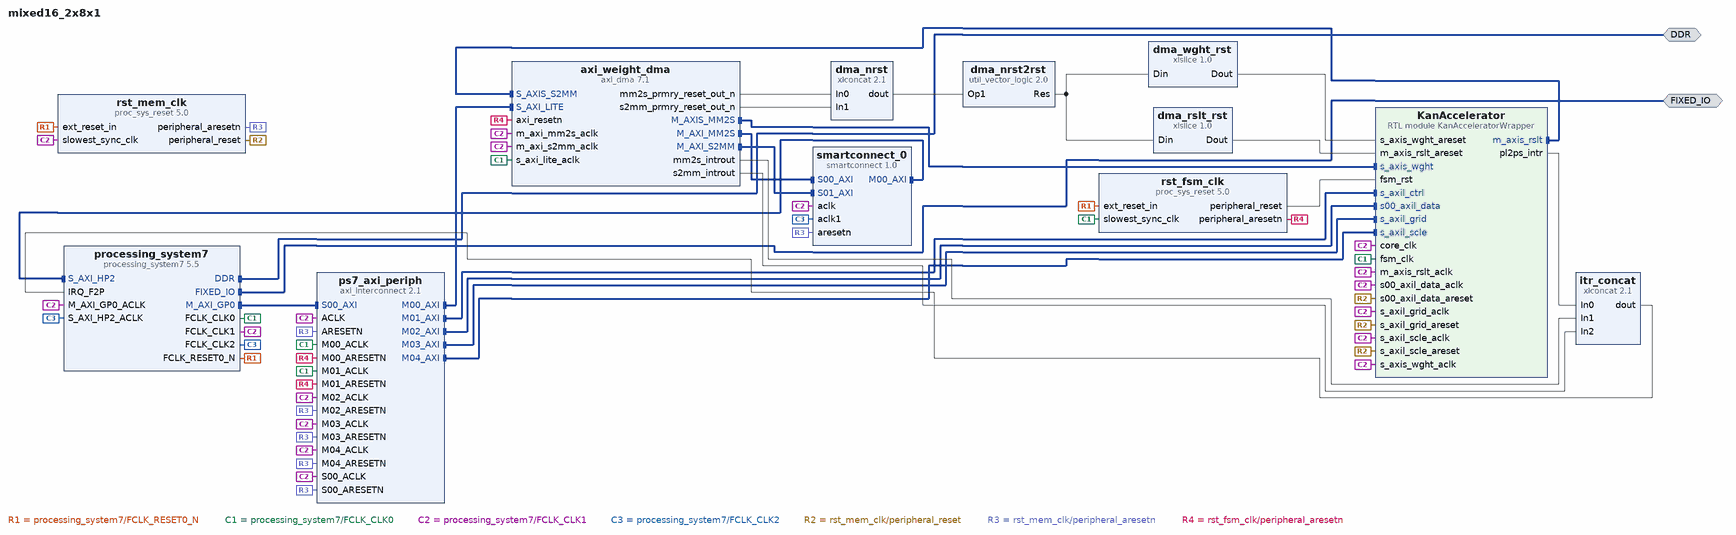
[diagram p0: block diagram of the top level]
# Vivado block design mixed16_2x8x1, xc7z007sclg400-1, Vivado 2022.1
create_bd_design mixed16_2x8x1

create_bd_intf_port -mode Master -vlnv xilinx.com:interface:ddrx_rtl:1.0 DDR
create_bd_intf_port -mode Master -vlnv xilinx.com:display_processing_system7:fixedio_rtl:1.0 FIXED_IO

create_bd_cell -type ip -vlnv xilinx.com:ip:axi_dma:7.1 axi_weight_dma
set_property -dict [list \
  CONFIG.c_include_s2mm 1 \
  CONFIG.c_include_sg 0 \
  CONFIG.c_m_axi_mm2s_data_width 128 \
  CONFIG.c_m_axis_mm2s_tdata_width 128 \
  CONFIG.c_micro_dma 0 \
  CONFIG.c_mm2s_burst_size 256 \
  CONFIG.c_sg_length_width 26 \
] [get_bd_cells axi_weight_dma]
create_bd_cell -type ip -vlnv xilinx.com:ip:xlconcat:2.1 dma_nrst
create_bd_cell -type ip -vlnv xilinx.com:ip:util_vector_logic:2.0 dma_nrst2rst
set_property -dict {CONFIG.C_OPERATION not CONFIG.C_SIZE 2} [get_bd_cells dma_nrst2rst]
create_bd_cell -type ip -vlnv xilinx.com:ip:xlslice:1.0 dma_rslt_rst
set_property -dict {CONFIG.DIN_FROM 1 CONFIG.DIN_TO 1 CONFIG.DIN_WIDTH 2} [get_bd_cells dma_rslt_rst]
create_bd_cell -type ip -vlnv xilinx.com:ip:xlslice:1.0 dma_wght_rst
set_property -dict {CONFIG.DIN_WIDTH 2} [get_bd_cells dma_wght_rst]
create_bd_cell -type ip -vlnv xilinx.com:ip:xlconcat:2.1 itr_concat
set_property -dict {CONFIG.NUM_PORTS 3} [get_bd_cells itr_concat]
create_bd_cell -type ip -vlnv xilinx.com:ip:processing_system7:5.5 processing_system7
set_property -dict [list \
  CONFIG.PCW_APU_PERIPHERAL_FREQMHZ 667 \
  CONFIG.PCW_CRYSTAL_PERIPHERAL_FREQMHZ 33.33333333 \
  CONFIG.PCW_ENET0_ENET0_IO {MIO 16 .. 27} \
  CONFIG.PCW_ENET0_GRP_MDIO_ENABLE 1 \
  CONFIG.PCW_ENET0_GRP_MDIO_IO {MIO 52 .. 53} \
  CONFIG.PCW_ENET0_PERIPHERAL_ENABLE 1 \
  CONFIG.PCW_ENET0_RESET_ENABLE 1 \
  CONFIG.PCW_ENET0_RESET_IO {MIO 9} \
  CONFIG.PCW_ENET_RESET_ENABLE 1 \
  CONFIG.PCW_ENET_RESET_SELECT {Share reset pin} \
  CONFIG.PCW_EN_CLK1_PORT 1 \
  CONFIG.PCW_EN_CLK2_PORT 1 \
  CONFIG.PCW_FPGA0_PERIPHERAL_FREQMHZ 62.5 \
  CONFIG.PCW_FPGA1_PERIPHERAL_FREQMHZ 125 \
  CONFIG.PCW_FPGA2_PERIPHERAL_FREQMHZ 250 \
  CONFIG.PCW_FPGA_FCLK1_ENABLE 1 \
  CONFIG.PCW_FPGA_FCLK2_ENABLE 1 \
  CONFIG.PCW_GPIO_MIO_GPIO_ENABLE 1 \
  CONFIG.PCW_GPIO_MIO_GPIO_IO MIO \
  CONFIG.PCW_I2C_RESET_ENABLE 1 \
  CONFIG.PCW_IRQ_F2P_INTR 1 \
  CONFIG.PCW_PERIPHERAL_BOARD_PRESET part0 \
  CONFIG.PCW_PRESET_BANK1_VOLTAGE {LVCMOS 1.8V} \
  CONFIG.PCW_QSPI_PERIPHERAL_ENABLE 0 \
  CONFIG.PCW_SD0_GRP_CD_ENABLE 1 \
  CONFIG.PCW_SD0_GRP_CD_IO {MIO 47} \
  CONFIG.PCW_SD0_GRP_WP_ENABLE 0 \
  CONFIG.PCW_SD0_PERIPHERAL_ENABLE 1 \
  CONFIG.PCW_SD0_SD0_IO {MIO 40 .. 45} \
  CONFIG.PCW_SDIO_PERIPHERAL_FREQMHZ 100 \
  CONFIG.PCW_UART0_PERIPHERAL_ENABLE 1 \
  CONFIG.PCW_UART0_UART0_IO {MIO 14 .. 15} \
  CONFIG.PCW_UART1_PERIPHERAL_ENABLE 0 \
  CONFIG.PCW_UART_PERIPHERAL_FREQMHZ 100 \
  CONFIG.PCW_UIPARAM_DDR_BUS_WIDTH {16 Bit} \
  CONFIG.PCW_UIPARAM_DDR_FREQ_MHZ 525 \
  CONFIG.PCW_UIPARAM_DDR_PARTNO {MT41K256M16 RE-125} \
  CONFIG.PCW_USB0_PERIPHERAL_ENABLE 1 \
  CONFIG.PCW_USB0_RESET_ENABLE 1 \
  CONFIG.PCW_USB0_RESET_IO {MIO 46} \
  CONFIG.PCW_USB0_USB0_IO {MIO 28 .. 39} \
  CONFIG.PCW_USB_RESET_ENABLE 1 \
  CONFIG.PCW_USB_RESET_SELECT {Share reset pin} \
  CONFIG.PCW_USE_FABRIC_INTERRUPT 1 \
  CONFIG.PCW_USE_S_AXI_HP2 1 \
] [get_bd_cells processing_system7]
# 508 more settings of processing_system7 are not shown: defaults, MIO pin electricals, DDR timing, and values the tool derives
create_bd_cell -type ip -vlnv xilinx.com:ip:axi_interconnect:2.1 ps7_axi_periph
set_property -dict [list \
  CONFIG.M00_HAS_DATA_FIFO 1 \
  CONFIG.M00_HAS_REGSLICE 4 \
  CONFIG.M01_HAS_DATA_FIFO 1 \
  CONFIG.M01_HAS_REGSLICE 4 \
  CONFIG.M02_HAS_DATA_FIFO 1 \
  CONFIG.M02_HAS_REGSLICE 4 \
  CONFIG.M03_HAS_DATA_FIFO 1 \
  CONFIG.M03_HAS_REGSLICE 4 \
  CONFIG.M04_HAS_DATA_FIFO 1 \
  CONFIG.M04_HAS_REGSLICE 4 \
  CONFIG.NUM_MI 5 \
  CONFIG.S00_HAS_DATA_FIFO 1 \
  CONFIG.S00_HAS_REGSLICE 4 \
  CONFIG.STRATEGY 1 \
] [get_bd_cells ps7_axi_periph]
create_bd_cell -type ip -vlnv xilinx.com:ip:proc_sys_reset:5.0 rst_fsm_clk
create_bd_cell -type ip -vlnv xilinx.com:ip:proc_sys_reset:5.0 rst_mem_clk
create_bd_cell -type ip -vlnv xilinx.com:ip:smartconnect:1.0 smartconnect_0
set_property -dict {CONFIG.ADVANCED_PROPERTIES { __view__ { }} CONFIG.NUM_CLKS 2} [get_bd_cells smartconnect_0]
create_bd_cell -type module -reference KanAcceleratorWrapper KanAccelerator
set_property -dict [list \
  CONFIG.CTRL_ADDR 14 \
  CONFIG.DATA_CHANNELS 2 \
  CONFIG.DMA_KEEP_WIDTH 16 \
  CONFIG.DMA_WIDTH 128 \
  CONFIG.GRID_ADDR 10 \
  CONFIG.GRID_DEPTH 1024 \
  CONFIG.RSLT_CHANNELS 8 \
  CONFIG.SCALE_ADDR 10 \
  CONFIG.SCALE_DEPTH 1024 \
  CONFIG.WEIGHT_FIFO_DEPTH 512 \
  CONFIG.WEIGHT_FRACTIONAL_BITS 10 \
  CONFIG.WEIGHT_KEEP_WIDTH 1 \
  CONFIG.WEIGHT_WIDTH 8 \
] [get_bd_cells KanAccelerator]

# ---- connections ----

connect_bd_intf_net -intf_net KanAcceleratorWrapper_0_m_axis_rslt [get_bd_intf_pins KanAccelerator/m_axis_rslt] [get_bd_intf_pins axi_weight_dma/S_AXIS_S2MM]
connect_bd_intf_net [get_bd_intf_pins axi_weight_dma/M_AXIS_MM2S] [get_bd_intf_pins KanAccelerator/s_axis_wght]
connect_bd_intf_net [get_bd_intf_pins smartconnect_0/S00_AXI] [get_bd_intf_pins axi_weight_dma/M_AXI_MM2S]
connect_bd_intf_net [get_bd_intf_pins smartconnect_0/S01_AXI] [get_bd_intf_pins axi_weight_dma/M_AXI_S2MM]
connect_bd_intf_net -intf_net processing_system7_0_DDR [get_bd_intf_ports DDR] [get_bd_intf_pins processing_system7/DDR]
connect_bd_intf_net -intf_net processing_system7_0_FIXED_IO [get_bd_intf_ports FIXED_IO] [get_bd_intf_pins processing_system7/FIXED_IO]
connect_bd_intf_net [get_bd_intf_pins processing_system7/M_AXI_GP0] [get_bd_intf_pins ps7_axi_periph/S00_AXI]
connect_bd_intf_net [get_bd_intf_pins ps7_axi_periph/M00_AXI] [get_bd_intf_pins axi_weight_dma/S_AXI_LITE]
connect_bd_intf_net [get_bd_intf_pins ps7_axi_periph/M01_AXI] [get_bd_intf_pins KanAccelerator/s_axil_ctrl]
connect_bd_intf_net [get_bd_intf_pins ps7_axi_periph/M02_AXI] [get_bd_intf_pins KanAccelerator/s00_axil_data]
connect_bd_intf_net [get_bd_intf_pins ps7_axi_periph/M03_AXI] [get_bd_intf_pins KanAccelerator/s_axil_grid]
connect_bd_intf_net [get_bd_intf_pins ps7_axi_periph/M04_AXI] [get_bd_intf_pins KanAccelerator/s_axil_scle]
connect_bd_intf_net [get_bd_intf_pins smartconnect_0/M00_AXI] [get_bd_intf_pins processing_system7/S_AXI_HP2]
connect_bd_net -net KanAcceleratorWrapper_0_pl2ps_intr [get_bd_pins KanAccelerator/pl2ps_intr] [get_bd_pins itr_concat/In0]
connect_bd_net [get_bd_pins axi_weight_dma/mm2s_introut] [get_bd_pins itr_concat/In1]
connect_bd_net [get_bd_pins axi_weight_dma/mm2s_prmry_reset_out_n] [get_bd_pins dma_nrst/In0]
connect_bd_net [get_bd_pins axi_weight_dma/s2mm_introut] [get_bd_pins itr_concat/In2]
connect_bd_net [get_bd_pins axi_weight_dma/s2mm_prmry_reset_out_n] [get_bd_pins dma_nrst/In1]
connect_bd_net [get_bd_pins dma_nrst2rst/Res] [get_bd_pins dma_wght_rst/Din] [get_bd_pins dma_rslt_rst/Din]
connect_bd_net [get_bd_pins dma_rslt_rst/Dout] [get_bd_pins KanAccelerator/m_axis_rslt_areset]
connect_bd_net [get_bd_pins dma_wght_rst/Dout] [get_bd_pins KanAccelerator/s_axis_wght_areset]
connect_bd_net -net processing_system7_0_FCLK_RESET0_N [get_bd_pins processing_system7/FCLK_RESET0_N] \
  [get_bd_pins rst_mem_clk/ext_reset_in] [get_bd_pins rst_fsm_clk/ext_reset_in]
connect_bd_net [get_bd_pins processing_system7/FCLK_CLK0] \
  [get_bd_pins ps7_axi_periph/M01_ACLK] [get_bd_pins rst_fsm_clk/slowest_sync_clk] [get_bd_pins ps7_axi_periph/M00_ACLK] \
  [get_bd_pins axi_weight_dma/s_axi_lite_aclk] [get_bd_pins KanAccelerator/fsm_clk]
connect_bd_net [get_bd_pins processing_system7/FCLK_CLK1] \
  [get_bd_pins processing_system7/M_AXI_GP0_ACLK] [get_bd_pins ps7_axi_periph/S00_ACLK] \
  [get_bd_pins rst_mem_clk/slowest_sync_clk] [get_bd_pins ps7_axi_periph/M02_ACLK] [get_bd_pins ps7_axi_periph/M03_ACLK] \
  [get_bd_pins ps7_axi_periph/M04_ACLK] [get_bd_pins ps7_axi_periph/ACLK] [get_bd_pins axi_weight_dma/m_axi_mm2s_aclk] \
  [get_bd_pins axi_weight_dma/m_axi_s2mm_aclk] [get_bd_pins smartconnect_0/aclk] [get_bd_pins KanAccelerator/core_clk] \
  [get_bd_pins KanAccelerator/s00_axil_data_aclk] [get_bd_pins KanAccelerator/s_axil_grid_aclk] \
  [get_bd_pins KanAccelerator/s_axil_scle_aclk] [get_bd_pins KanAccelerator/s_axis_wght_aclk] \
  [get_bd_pins KanAccelerator/m_axis_rslt_aclk]
connect_bd_net [get_bd_pins processing_system7/FCLK_CLK2] [get_bd_pins processing_system7/S_AXI_HP2_ACLK] [get_bd_pins smartconnect_0/aclk1]
connect_bd_net [get_bd_pins rst_mem_clk/peripheral_reset] \
  [get_bd_pins KanAccelerator/s00_axil_data_areset] [get_bd_pins KanAccelerator/s_axil_grid_areset] \
  [get_bd_pins KanAccelerator/s_axil_scle_areset]
connect_bd_net -net rst_ps7_125M_peripheral_aresetn [get_bd_pins rst_mem_clk/peripheral_aresetn] \
  [get_bd_pins ps7_axi_periph/S00_ARESETN] [get_bd_pins ps7_axi_periph/M02_ARESETN] [get_bd_pins ps7_axi_periph/M03_ARESETN] \
  [get_bd_pins ps7_axi_periph/M04_ARESETN] [get_bd_pins ps7_axi_periph/ARESETN] [get_bd_pins smartconnect_0/aresetn]
connect_bd_net -net rst_ps7_62M_peripheral_aresetn [get_bd_pins rst_fsm_clk/peripheral_aresetn] \
  [get_bd_pins ps7_axi_periph/M01_ARESETN] [get_bd_pins ps7_axi_periph/M00_ARESETN] [get_bd_pins axi_weight_dma/axi_resetn]
connect_bd_net -net rst_ps7_62M_peripheral_reset [get_bd_pins rst_fsm_clk/peripheral_reset] [get_bd_pins KanAccelerator/fsm_rst]
connect_bd_net -net xlconcat_0_dout [get_bd_pins itr_concat/dout] [get_bd_pins processing_system7/IRQ_F2P]
connect_bd_net -net xlconcat_1_dout [get_bd_pins dma_nrst/dout] [get_bd_pins dma_nrst2rst/Op1]

# ---- address map ----
assign_bd_address -offset 0x00000000 -range 512M -target_address_space [get_bd_addr_spaces axi_weight_dma/Data_MM2S] [get_bd_addr_segs processing_system7/S_AXI_HP2/HP2_DDR_LOWOCM]
assign_bd_address -offset 0x00000000 -range 512M -target_address_space [get_bd_addr_spaces axi_weight_dma/Data_S2MM] [get_bd_addr_segs processing_system7/S_AXI_HP2/HP2_DDR_LOWOCM]
assign_bd_address -offset 0x40000000 -range 32K -target_address_space [get_bd_addr_spaces processing_system7/Data] [get_bd_addr_segs KanAccelerator/s00_axil_data/reg0]
assign_bd_address -offset 0x40008000 -range 1K -target_address_space [get_bd_addr_spaces processing_system7/Data] [get_bd_addr_segs KanAccelerator/s_axil_grid/reg0]
assign_bd_address -offset 0x40008400 -range 1K -target_address_space [get_bd_addr_spaces processing_system7/Data] [get_bd_addr_segs KanAccelerator/s_axil_scle/reg0]
assign_bd_address -offset 0x40008800 -range 1K -target_address_space [get_bd_addr_spaces processing_system7/Data] [get_bd_addr_segs KanAccelerator/s_axil_ctrl/reg0]
assign_bd_address -offset 0x40400000 -range 64K -target_address_space [get_bd_addr_spaces processing_system7/Data] [get_bd_addr_segs axi_weight_dma/S_AXI_LITE/Reg]

validate_bd_design
save_bd_design
